# Altium schematic sheet LMZM33603.SchDoc
size 431 x 279 mm; Date: Not shown in title block; ApprovedBy: Not shown in title block; CheckedBy: Not shown in title block; Author: Not shown in title block; CompanyName: Not shown in title block; DrawnBy: Andy Lin (TI); Engineer: Not shown in title block; Organization: Not shown in title block; Address1: Not shown in title block; Address2: Not shown in title block; Address3: Not shown in title block; Address4: Not shown in title block; DocumentNumber: 7; Revision: Use project parameter SCH_Rev; SheetNumber: 7; SheetTotal: 14; PageSetup: Record=PageOptions|CenterHorizontal=True|CenterVertical=True|PrintScale=1.00|XCorrection=1.00|YCorrection=1.00|PrintKind=0|BorderSize=5000000|LeftOffset=0|BottomOffset=0|Orientation=2|PaperLength=1000|PaperWidth=1000|Scale=100|PaperSource=15|PrintQuality=600|MediaType=1|DitherType=10|PaperKind=Letter|PrintScaleMode=1; CurrentTime: Not shown in title block; CurrentDate: Not shown in title block; Time: Not shown in title block; DocumentFullPathAndName: Not shown in title block; DocumentName: Not shown in title block; ModifiedDate: Not shown in title block; ImagePath: Not shown in title block
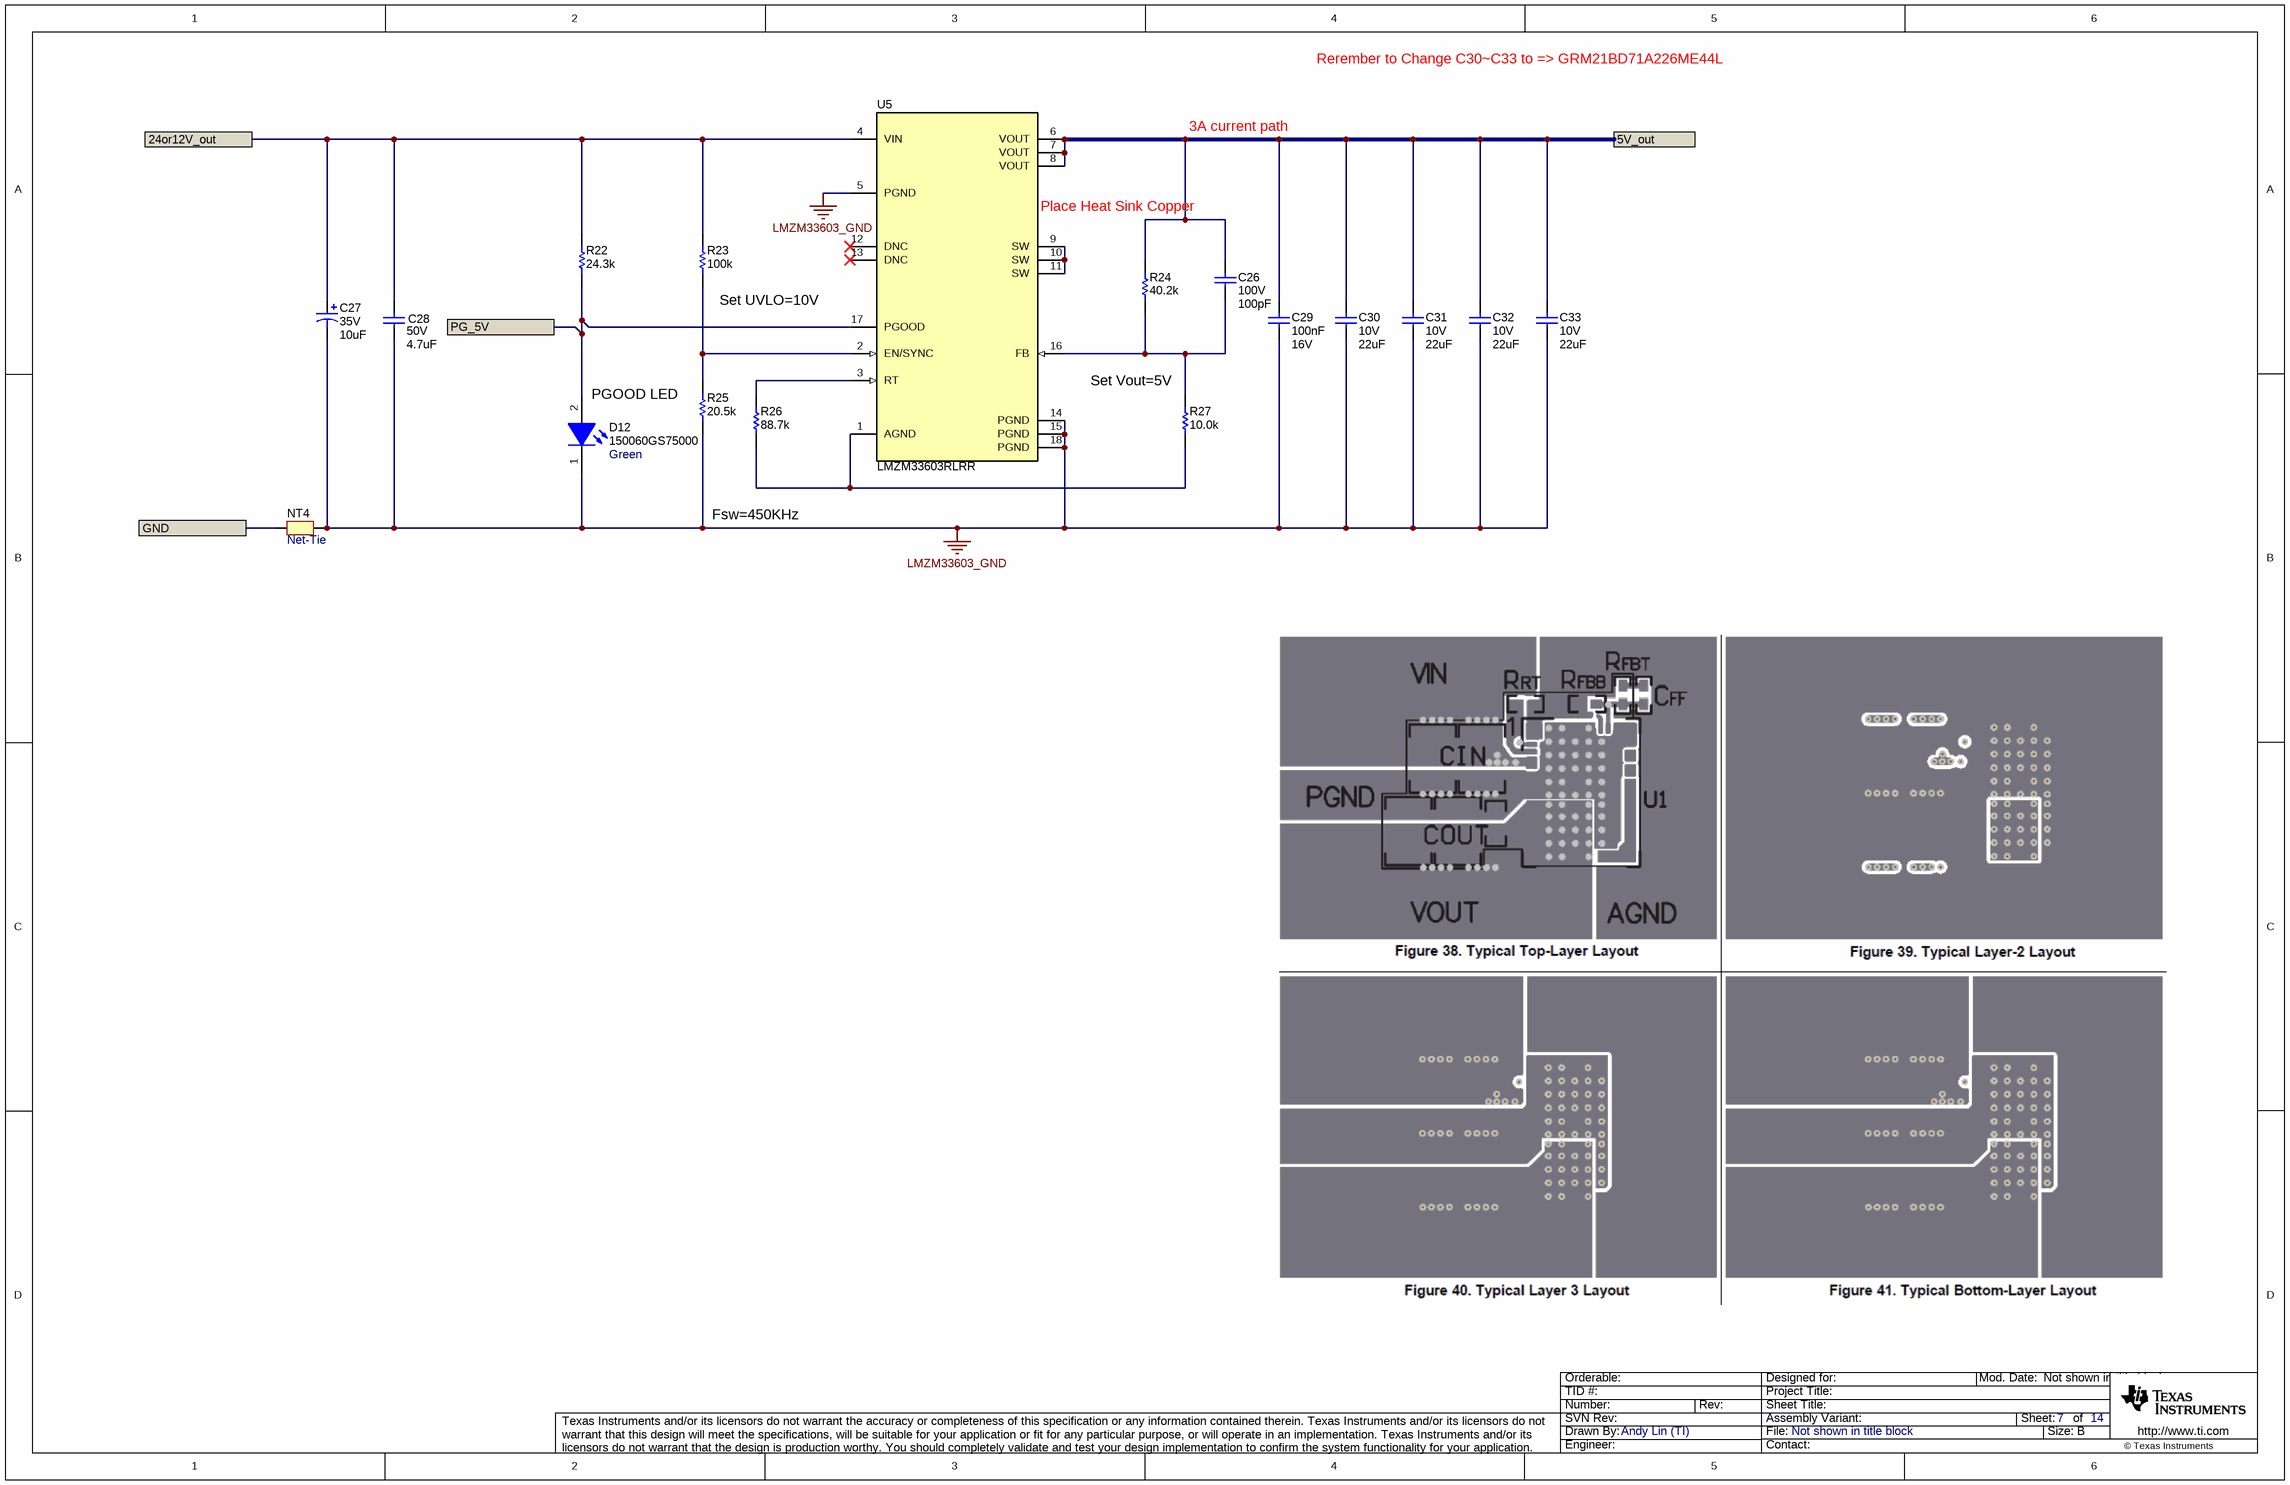
[diagram p0: LMZM33603.SchDoc]

## Parts
C26  VDC_V: 100V  ValueDisplayed: 100pF  [0603]  (hidden comment: GRM1885C2A101JA01D)
C27  VDC_V: 35V  ValueDisplayed: 10uF  [7343-31]  (hidden comment: 593D106X9035D2TE3)
C28  VDC_V: 50V  ValueDisplayed: 4.7uF  [1210_270]  (hidden comment: GRM32ER71H475KA88L)
C29  Cap_F: 100nF  VDC_V: 16V  [0603]  (hidden comment: GRM188R71C104KA01D)
C30  VDC_V: 10V  ValueDisplayed: 22uF  [0805_HV]  (hidden comment: GRM21BZ71A226ME15L)
C31  VDC_V: 10V  ValueDisplayed: 22uF  [0805_HV]  (hidden comment: GRM21BZ71A226ME15L)
C32  VDC_V: 10V  ValueDisplayed: 22uF  [0805_HV]  (hidden comment: GRM21BZ71A226ME15L)
C33  VDC_V: 10V  ValueDisplayed: 22uF  [0805_HV]  (hidden comment: GRM21BZ71A226ME15L)
D12  150060GS75000  value Green  [WL-SMCW_GREEN]
NT4  Net-Tie  [Net-Tie_50milWide_30milLong]  (net tie, no BOM)
R22  ValueDisplayed: 24.3k  [0603]  (hidden comment: CRCW060324K3FKEA)
R23  ValueDisplayed: 100k  [0402]  (hidden comment: CRCW0402100KFKED)
R24  ValueDisplayed: 40.2k  [0402]  (hidden comment: CRCW040240K2FKED)
R25  ValueDisplayed: 20.5k  [0402]  (hidden comment: CRCW040220K5FKED)
R26  ValueDisplayed: 88.7k  [0402]  (hidden comment: CRCW040288K7FKED)
R27  ValueDisplayed: 10.0k  [0402]  (hidden comment: CRCW040210K0FKED)
U5  LMZM33603RLRR  [RLR0018A]

## Ports
5V_out, 24or12V_out, GND, PG_5V

## Nets
LMZM33603_GND: C27.2(-) C28.2 C29.2 C30.2 C31.2 C32.2 C33.2 D12.1(K) NT4.2 R25.1 U5.5(PGND) U5.14(PGND) U5.15(PGND) U5.18(PGND)
5V_out: C26.1 C29.1 C30.1 C31.1 C32.1 C33.1 R24.2 U5.6(VOUT) U5.7(VOUT) U5.8(VOUT) ; port 5V_out
24or12V_out: C27.1(+) C28.1 R22.2 R23.2 U5.4(VIN) ; port 24or12V_out
GND: NT4.1 ; port GND
PG_5V: D12.2(A) R22.1 U5.17(PGOOD) ; port PG_5V
NetC26_2: C26.2 R24.1 R27.2 U5.16(FB)
NetR23_1: R23.1 R25.2 U5.2(EN/SYNC)
NetR26_1: R26.1 R27.1 U5.1(AGND)
NetR26_2: R26.2 U5.3(RT)
NetU5_9: U5.9(SW) U5.10(SW) U5.11(SW)

Not connected (* = marked no-connect by the designer): U5 12(DNC)* 13(DNC)*

## Notes on the sheet
- Rerember to Change C30~C33 to => GRM21BD71A226ME44L
- 3A current path
- (near U5) Place Heat Sink Copper
- (near R23) Set UVLO=10V
- PGOOD LED
- (near R27) Set Vout=5V
- Fsw=450KHz
- Drawn By:
- SVN Rev:
- Number:
- TID #:
- Orderable:
- Rev:
- Sheet Title:
- File:
- Project Title:
- Designed for:
- Assembly Variant:
- Mod. Date:
- Sheet:
- Size:
- of
- B
- http://www.ti.com
- Texas Instruments and/or its licensors do not warrant the accuracy or completeness of this specification or any information contained therein. Texas Instruments and/or its licensors do not warrant that this design will meet the specifications, will be suitable for your application or fit for any particular purpose, or will operate in an implementation. Texas Instruments and/or its licensors do not warrant that the design is production worthy. You should completely validate and test your design implementation to confirm the system functionality for your application.
- Engineer:
- Contact:
- © Texas Instruments

## Library data of the parts
C26 = CMP-0007237-1: CAP, CERM, 100 pF, 100 V, +/- 5%, C0G/NP0, 0603; Manufacturer: MuRata; TaMin_C: -55°C; Polarized: N; SizeAreaWB_mm2: 4.68; Value1: Unknown; U/M: EA; Value: 100pF; TaMax_C: 125°C; SizeZ_mm: 1; SizeX_mm: 1.6; SizeY_mm: 0.8; SizeArea_mm2: 1.28; AEC Category: Q200; ComponentLink1URL: http://search.murata.co.jp/Ceramy/PnsearchViewAction.do?HnOFG=ON&HnNFG=ON&SEL_CNT=50&sLang=en&sKey=GRM1885C2A101JA01D&x=9&y=9&search=startwith; Supplier Part Number 2: 81-GRM1885C2A101JA01; Publisher: Texas Instruments; Supplier 2: Mouser; Supplier Part Number 3: 1828919; TempCo: C0G/NP0; Supplier 3: Farnell; Published: 2008-06-19; RoHS: Y; MountType: SMT; Supplier 1: Digi-Key; PackageReference: 0603; Tolerance_%: 5%; Cap_Case: 0603; Value2: 100V; CompType: Capacitor; LatestRevisionDate: 2017-03-09; PartNumber: GRM1885C2A101JA01D; AEC Qualified: ?; Cap_F: 100pF; ComponentLink1Description: Datasheet link; Supplier Part Number 1: 490-1351-1-ND; Technology: Ceramic
C27 = CMP-0011718-1: CAP, TA, 10 uF, 35 V, +/- 10%, 0.3 ohm, SMD; Manufacturer: Vishay-Sprague; TaMin_C: -55°C; ESR_ohm: 0.3; Polarized: Y; SizeAreaWB_mm2: 58.59; Value1: 0.3 ohm; U/M: EA; Value: 10uF; TaMax_C: 125°C; SizeZ_mm: 3.1; SizeX_mm: 7.3; SizeY_mm: 4.3; Cap_Case: D; SizeArea_mm2: 31.39; CompType: Capacitor; Cap_F: 10µF; IRMS_A: 710mA; AEC Category: Q200; ComponentLink1URL: http://www.vishay.com/docs/40005/593d.pdf; Supplier Part Number 2: 65K2991; Publisher: Texas Instruments; Supplier 2: Newark; Supplier Part Number 3: 74-593D106X9035D2TE3; Supplier 3: Mouser; RoHS: Y; MountType: SMT; Supplier 1: Digi-Key; LatestRevisionNote: Updated supplier links; PackageReference: 7343-31; Tolerance_%: 10%; Value2: 35V; LatestRevisionDate: 2017-03-09; PartNumber: 593D106X9035D2TE3; AEC Qualified: ?; Series: 593D; ComponentLink1Description: Datasheet link; Supplier Part Number 1: 718-1099-1-ND; Technology: TA
C28 = CMP-0009228-1: CAP, CERM, 4.7 uF, 50 V, +/- 10%, X7R, 1210; Manufacturer: MuRata; TaMin_C: -55°C; ESR_ohm: 2m; Polarized: N; SizeAreaWB_mm2: 14.7; Value1: 0.002 ohm; U/M: EA; Value: 4.7uF; TaMax_C: 125°C; SizeZ_mm: 2.7; SizeX_mm: 3.2; SizeY_mm: 2.5; Cap_Case: 1210; SizeArea_mm2: 8; Cap_F: 4.7µF; AEC Category: Q200; ComponentLink1URL: http://search.murata.co.jp/Ceramy/PnsearchViewAction.do?HnOFG=ON&HnNFG=ON&SEL_CNT=50&sLang=en&sKey=GRM32ER71H475KA88L&x=9&y=9&search=startwith; Supplier Part Number 2: 81-GRM32R71H475KA88L; Publisher: Texas Instruments; Supplier 2: Mouser; Supplier Part Number 3: 1828841; TempCo: X7R; Supplier 3: Farnell; Published: 2008-06-19; RoHS: Y; MountType: SMT; Supplier 1: Digi-Key; PackageReference: 1210; Tolerance_%: 10%; Value2: 50V; CompType: Capacitor; LatestRevisionDate: 2017-03-09; PartNumber: GRM32ER71H475KA88L; AEC Qualified: ?; ComponentLink1Description: Datasheet link; Supplier Part Number 1: 490-1864-1-ND; Technology: Ceramic
C29 = CMP-0007378-4: CAP, CERM, 0.1 uF, 16 V, +/- 10%, X7R, 0603; Manufacturer: MuRata; TaMin_C: -55°C; Polarized: N; SizeAreaWB_mm2: 4.68; Value1: Unknown; U/M: EA; Value: 0.1uF; TaMax_C: 125°C; SizeZ_mm: 1; SizeX_mm: 1.6; SizeY_mm: 0.8; SizeArea_mm2: 1.28; AEC Category: Q200; Supplier Part Number 2: 81-GRM39X104K16; Publisher: Texas Instruments; Supplier 2: Mouser; Supplier Part Number 3: 1828890; TempCo: X7R; Supplier 3: Farnell; Published: 2008-06-19; RoHS: Y; MountType: SMT; Supplier 1: Digi-Key; PackageReference: 0603; Tolerance_%: 10%; Cap_Case: 0603; Value2: 16V; CompType: Capacitor; LatestRevisionDate: 2017-03-09; PartNumber: GRM188R71C104KA01D; AEC Qualified: ?; ComponentLink1Description: Datasheet link; Supplier Part Number 1: 490-1532-1-ND; Technology: Ceramic; ValueDisplayed: 0.1uF; ComponentLink1URL: http://search.murata.co.jp/Ceramy/PnsearchViewAction.do?HnOFG=ON&HnNFG=ON&SEL_CNT=50&sLang=en&sKey=GRM188R71C104KA01D&x=9&y=9&search=startwith
C30-C33 = CMP-0008377-2: CAP, CERM, 22 uF, 10 V, +/- 20%, X7R, 0805; Manufacturer: MuRata; SizeY_mm: 1.25; Cap_Case: 0805; SizeArea_mm2: 2.5; AEC Qualified: N; Cap_F: 22µF; AEC Category: Q200; TaMin_C: -55°C; SizeAreaWB_mm2: 6.75; Value1: Unknown; U/M: EA; Value: 22uF; TaMax_C: 125°C; SizeZ_mm: 1.45; SizeX_mm: 2; Value2: 10V; CompType: Capacitor; LatestRevisionDate: 2017-03-09; PartNumber: GRM21BZ71A226ME15L; ComponentLink1Description: Datasheet link; AEC Grade: N/A; Supplier Part Number 1: 81-GRM21BZ71A226ME5L; Technology: Ceramic; ComponentLink1URL: http://psearch.en.murata.com/capacitor/product/GRM21BZ71A226ME15%23.pdf; Publisher: Texas Instruments; Polarized: N; TempCo: X7R; Published: 2008-06-19; RoHS: Y; MountType: SMT; Supplier 1: Mouser; PackageReference: 0805; Tolerance_%: 20%
D12 = CMP-0002905-2: LED, Green, SMD; Manufacturer: Wurth Elektronik; Value1: W; Type: InGaN; Value2: 3.2V; Io_A: 20mA; Angle: 140; Tjmax_C: 85°C; Color: Green; Vf_V: 3.2V; PartNumber: 150060GS75000; ComponentLink1Description: Datasheet link; ComponentLink1URL: http://katalog.we-online.de/led/datasheet/150060GS75000.pdf; MountType: SMT; PackageReference: LED_0603; CompType: LED; RoHS: Y
NT4 = CMP-0078142-2: Single point connection between nets.; CompType: Net-Tie; PackageReference: N/A; Library Reference: Net-Tie; Manufacturer: N/A; PartNumber: N/A; MountType: SMT
R22 = CMP-0022236-1: RES, 24.3 k, 1%, 0.1 W, 0603; Manufacturer: Vishay-Dale; Power_W: 100mW; TempCo: 100 ppm/C; Value_Code: 24k3; U/M: EA; Value: 24.3k; EIA_Code: E96; SizeX_mm: 1.6; SizeY_mm: 0.8; SizeZ_mm: 1; Value2: 0.1W; SizeArea_mm2: 1.28; VDC_V: 75V; AEC Category: Q200; ComponentLink1URL: http://www.vishay.com/docs/20035/dcrcwe3.pdf; Supplier Part Number 2: 52K8314; Publisher: Texas Instruments; Supplier 2: Newark; Supplier Part Number 3: 71-CRCW0603-24.3K-E3; Supplier 3: Mouser; Published: 2008-06-26; RoHS: Y; Value1: 1%; MountType: SMT; Supplier 1: Digi-Key; PackageReference: 0603; Tolerance_%: 1%; Res_ohm: 24.3k; CompType: Resistor; LatestRevisionDate: 2017-03-09; PartNumber: CRCW060324K3FKEA; AEC Qualified: ?; ComponentLink1Description: Datasheet link; Supplier Part Number 1: 541-24.3KHCT-ND; Technology: Thick Film
R23 = CMP-0025950-3: RES, 100 k, 1%, 0.063 W, AEC-Q200 Grade 0, 0402; Manufacturer: Vishay-Dale; Power_W: 63mW; TempCo: 100 ppm/C; Value: 100k; EIA_Code: E96; SizeX_mm: 1; SizeY_mm: 0.5; SizeZ_mm: 0.6; Value2: 0.063W; AEC Qualified: Y; VDC_V: 50V; AEC Category: Q200; AEC Grade: 0; Supplier Part Number 2: 52K6607; Supplier 2: Newark; Supplier Part Number 3: 71-CRCW0402-100K-E3; Supplier 3: Mouser; Value_Code: 100k; RoHS: E; Value1: 1%; MountType: SMT; Supplier 1: Digi-Key; PackageReference: 0402; Tolerance_%: 1%; Res_ohm: 100k; SizeArea_mm2: 0.5; CompType: Resistor; PartNumber: CRCW0402100KFKED; ComponentLink1Description: Datasheet link; Supplier Part Number 1: 541-100KLCT-ND; Technology: Thick Film; ComponentLink1URL: http://www.vishay.com/docs/20035/dcrcwe3.pdf
R24 = CMP-0026367-2: RES, 40.2 k, 1%, 0.063 W, AEC-Q200 Grade 0, 0402; Manufacturer: Vishay-Dale; Power_W: 63mW; TempCo: 100 ppm/C; Value_Code: 40k2; Value: 40.2k; EIA_Code: E96; SizeX_mm: 1; SizeY_mm: 0.5; SizeZ_mm: 0.6; Value2: 0.063W; AEC Qualified: Y; VDC_V: 50V; AEC Category: Q200; AEC Grade: 0; ComponentLink1URL: http://www.vishay.com/docs/20035/dcrcwe3.pdf; Supplier Part Number 2: 52K7049; Supplier 2: Newark; Supplier Part Number 3: 71-CRCW0402-40.2K-E3; Supplier 3: Mouser; RoHS: E; Value1: 1%; MountType: SMT; Supplier 1: Digi-Key; PackageReference: 0402; Tolerance_%: 1%; Res_ohm: 40.2k; SizeArea_mm2: 0.5; CompType: Resistor; PartNumber: CRCW040240K2FKED; ComponentLink1Description: Datasheet link; Supplier Part Number 1: 541-40.2KLCT-ND; Technology: Thick Film
R25 = CMP-0026163-2: RES, 20.5 k, 1%, 0.063 W, AEC-Q200 Grade 0, 0402; Manufacturer: Vishay-Dale; Power_W: 63mW; TempCo: 100 ppm/C; Value_Code: 20k5; Value: 20.5k; EIA_Code: E96; SizeX_mm: 1; SizeY_mm: 0.5; SizeZ_mm: 0.6; Value2: 0.063W; AEC Qualified: Y; VDC_V: 50V; AEC Category: Q200; AEC Grade: 0; ComponentLink1URL: http://www.vishay.com/docs/20035/dcrcwe3.pdf; Supplier Part Number 2: 52K6819; Supplier 2: Newark; Supplier Part Number 3: 71-CRCW0402-20.5K-E3; Supplier 3: Mouser; RoHS: E; Value1: 1%; MountType: SMT; Supplier 1: Digi-Key; PackageReference: 0402; Tolerance_%: 1%; Res_ohm: 20.5k; SizeArea_mm2: 0.5; CompType: Resistor; PartNumber: CRCW040220K5FKED; ComponentLink1Description: Datasheet link; Supplier Part Number 1: 541-20.5KLCT-ND; Technology: Thick Film
R26 = CMP-0026586-2: RES, 88.7 k, 1%, 0.063 W, AEC-Q200 Grade 0, 0402; Manufacturer: Vishay-Dale; Power_W: 63mW; TempCo: 100 ppm/C; Value_Code: 88k7; Value: 88.7k; EIA_Code: E96; SizeX_mm: 1; SizeY_mm: 0.5; SizeZ_mm: 0.6; Value2: 0.063W; AEC Qualified: Y; VDC_V: 50V; AEC Category: Q200; AEC Grade: 0; ComponentLink1URL: http://www.vishay.com/docs/20035/dcrcwe3.pdf; Supplier Part Number 2: 52K7326; Supplier 2: Newark; Supplier Part Number 3: 71-CRCW0402-88.7K-E3; Supplier 3: Mouser; RoHS: E; Value1: 1%; MountType: SMT; Supplier 1: Digi-Key; PackageReference: 0402; Tolerance_%: 1%; Res_ohm: 88.7k; SizeArea_mm2: 0.5; CompType: Resistor; PartNumber: CRCW040288K7FKED; ComponentLink1Description: Datasheet link; Supplier Part Number 1: 541-88.7KLCT-ND; Technology: Thick Film
R27 = CMP-0025958-3: RES, 10.0 k, 1%, 0.063 W, AEC-Q200 Grade 0, 0402; Manufacturer: Vishay-Dale; Power_W: 63mW; TempCo: 100 ppm/C; Value_Code: 10k0; Value: 10.0k; EIA_Code: E96; Res_ohm: 10k; SizeX_mm: 1; SizeY_mm: 0.5; SizeZ_mm: 0.6; Value2: 0.063W; AEC Qualified: Y; VDC_V: 50V; AEC Category: Q200; AEC Grade: 0; Supplier Part Number 2: 52K6595; Supplier 2: Newark; Supplier Part Number 3: 71-CRCW0402-10K-E3; Supplier 3: Mouser; RoHS: E; Value1: 1%; MountType: SMT; Supplier 1: Digi-Key; PackageReference: 0402; Tolerance_%: 1%; SizeArea_mm2: 0.5; CompType: Resistor; PartNumber: CRCW040210K0FKED; ComponentLink1Description: Datasheet link; Supplier Part Number 1: 541-10.0KLCT-ND; Technology: Thick Film; ComponentLink1URL: http://www.vishay.com/docs/20035/dcrcwe3.pdf
U5 = CMP-0081433-1: 4V to 36V, 2A Step-Down DC/DC Power Module in Compact 7x9x4mm QFN Package, RLR0018A (B3QFN-18); Alternate PartNumber: LMZM33603RLRT; Alternate Manufacturer: Texas Instruments; SizeAreaWB_mm2: 99; Rating: Catalog; SizeZ_mm: 4.1; SizeX_mm: 7; SizeY_mm: 9; SizeArea_mm2: 63; CompType: IC; AEC Qualified: N; AEC Category: Q200; ComponentLink1URL: http://www.ti.com/lit/ds/symlink/lmzm33603.pdf; PackageDescription: B3QFN-18; RoHS: Y; MountType: SMT; ComponentLink2URL: http://www.ti.com/product/lmzm33603; ComponentLink3Description: Online Datasheet; ComponentLink2Description: Product Folder; Manufacturer: Texas Instruments; ComponentLink3URL: http://www.ti.com/product/lmzm33603/datasheet; PackageReference: RLR0018A; Operating Temprature Range: -40 to 105 C; PartNumber: LMZM33603RLRR; ComponentLink1Description: Datasheet Link